# EAGLE design M141X (EAGLE 4.11)
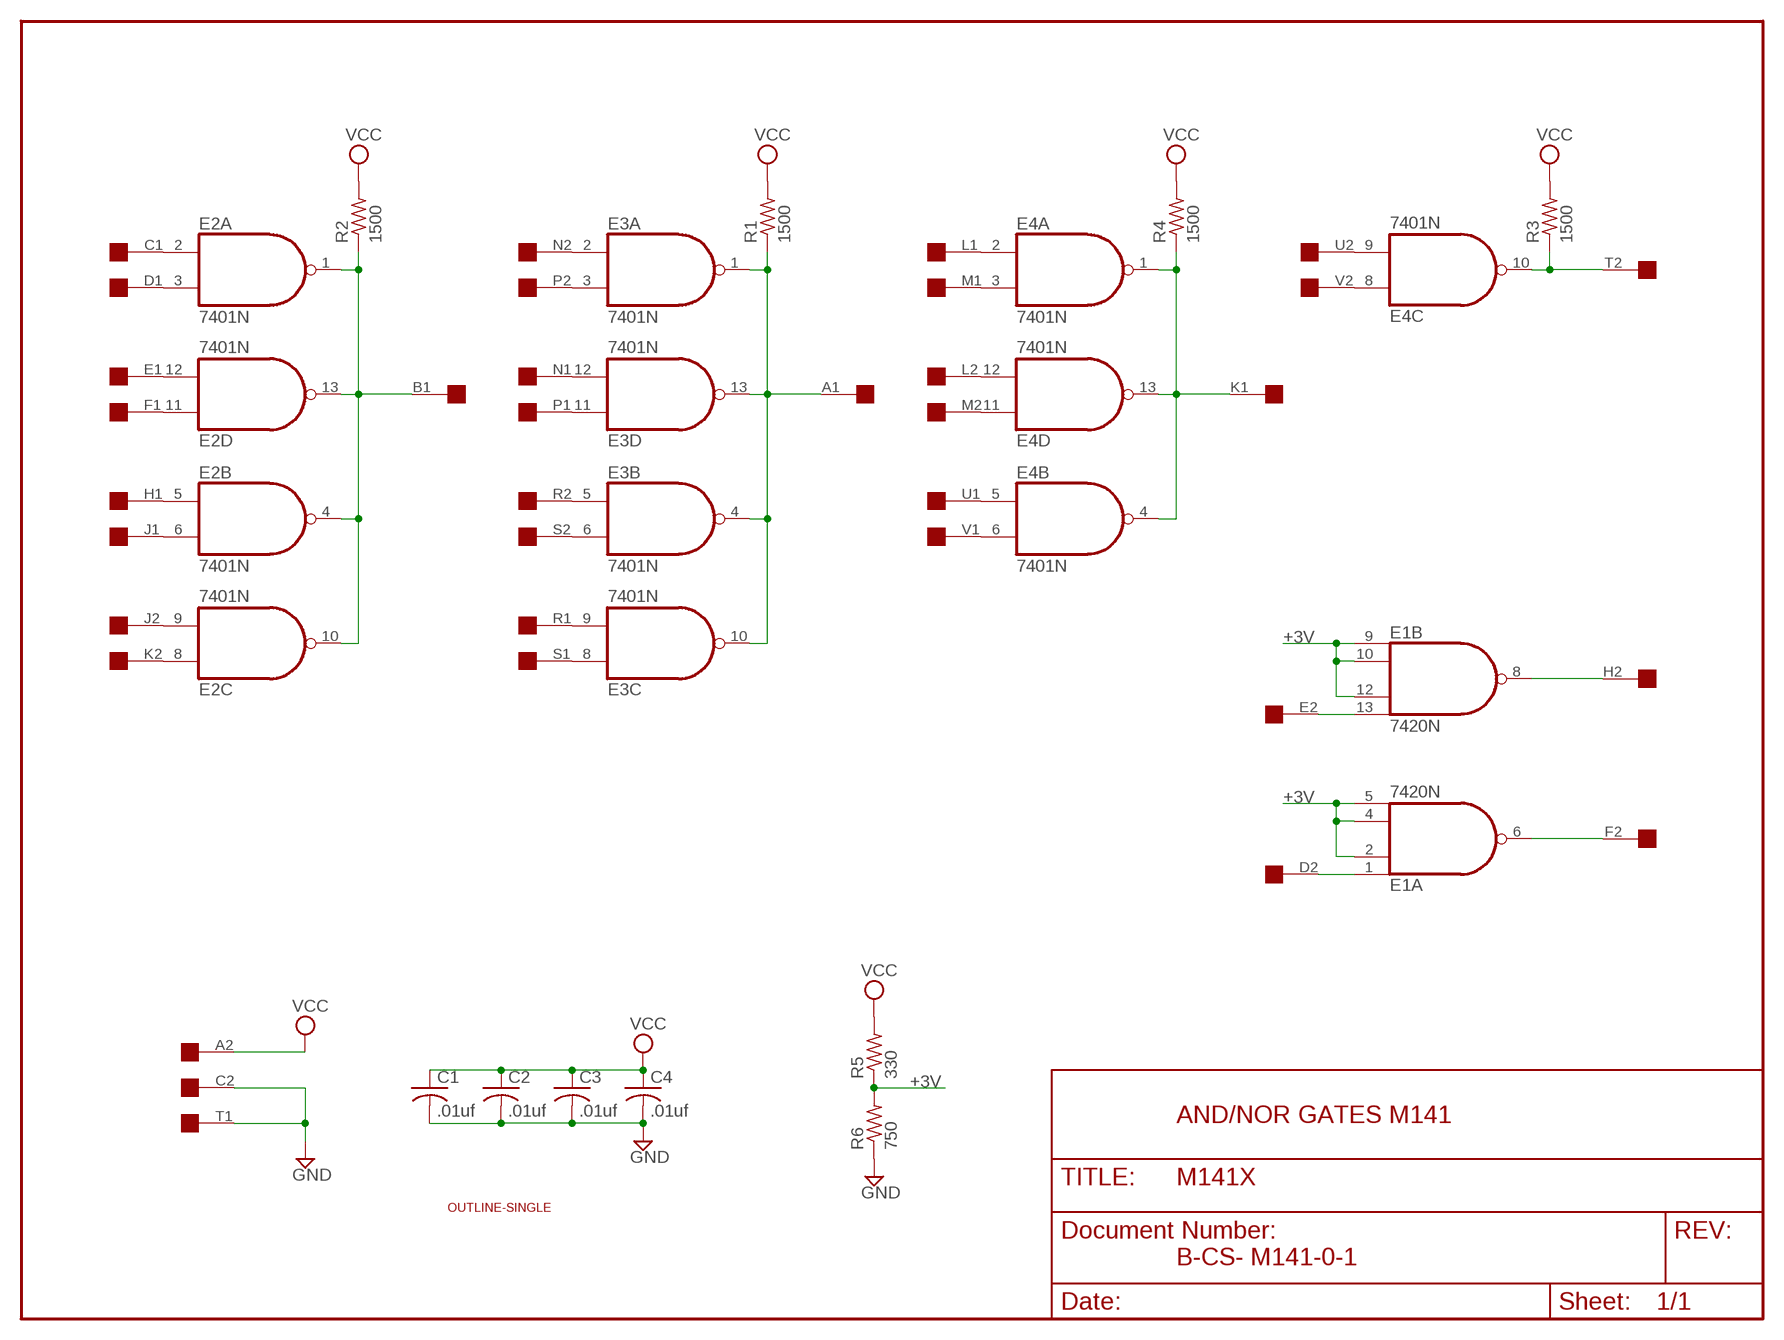
[diagram p0: schematic, sheet 1]

## Parts
C1  .01uf  C-US050-025X075  [C050-025X075]
C2  .01uf  C-US050-025X075  [C050-025X075]
C3  .01uf  C-US050-025X075  [C050-025X075]
C4  .01uf  C-US050-025X075  [C050-025X075]
E1  7420N  74S20N  [DIL14]
E2  7401N  74LS01N  [DIL14]
E3  7401N  74LS01N  [DIL14]
E4  7401N  74LS01N  [DIL14]
R1  1500  R-US_0207/10  [0207/10]
R2  1500  R-US_0207/10  [0207/10]
R3  1500  R-US_0207/10  [0207/10]
R4  1500  R-US_0207/10  [0207/10]
R5  330  R-US_0207/10  [0207/10]
R6  750  R-US_0207/10  [0207/10]
U$1  OUTLINE-SINGLE  [SINGLE]
U$4  SINGLE  [EDGE-CON2]

## Nets
+3V: E1.2(A:I1) E1.4(A:I2) E1.5(A:I3) E1.9(B:I0) E1.10(B:I1) E1.12(B:I2) R5.1 R6.2
GND [Supply]: C1.2 C2.2 C3.2 C4.2 R6.1 U$4.C2 U$4.T1
N$1: E2.2(A:I0) U$4.C1
N$2: E2.3(A:I1) U$4.D1
N$3: E2.12(D:I1) U$4.E1
N$4: E2.11(D:I0) U$4.F1
N$5: E2.5(B:I0) U$4.H1
N$6: E2.6(B:I1) U$4.J1
N$7: E2.8(C:I0) U$4.K2
N$8: E2.9(C:I1) U$4.J2
N$9: E2.1(A:O) E2.4(B:O) E2.10(C:O) E2.13(D:O) R2.1 U$4.B1
N$10: E3.3(A:I1) U$4.P2
N$11: E3.2(A:I0) U$4.N2
N$12: E3.12(D:I1) U$4.N1
N$13: E3.11(D:I0) U$4.P1
N$14: E3.6(B:I1) U$4.S2
N$15: E3.5(B:I0) U$4.R2
N$16: E3.9(C:I1) U$4.R1
N$17: E3.8(C:I0) U$4.S1
N$18: E3.1(A:O) E3.4(B:O) E3.10(C:O) E3.13(D:O) R1.1 U$4.A1
N$19: E4.12(D:I1) U$4.L2
N$20: E4.11(D:I0) U$4.M2
N$21: E4.2(A:I0) U$4.L1
N$22: E4.3(A:I1) U$4.M1
N$23: E4.5(B:I0) U$4.U1
N$24: E4.6(B:I1) U$4.V1
N$25: E4.1(A:O) E4.4(B:O) E4.13(D:O) R4.1 U$4.K1
N$26: E4.9(C:I1) U$4.U2
N$27: E4.8(C:I0) U$4.V2
N$28: E4.10(C:O) R3.1 U$4.T2
N$29: E1.8(B:O) U$4.H2
N$30: E1.6(A:O) U$4.F2
N$31: E1.13(B:I3) U$4.E2
N$32: E1.1(A:I0) U$4.D2
VCC [Supply]: C1.1 C2.1 C3.1 C4.1 R1.2 R2.2 R3.2 R4.2 R5.2 U$4.A2
Unconnected: U$4.B2

## Notes on the sheet
- AND/NOR GATES M141
- B-CS- M141-0-1

## Power pins joined to a net without a drawn wire
GND: E1.7(P:GND) E2.7(P:GND) E3.7(P:GND) E4.7(P:GND)
VCC: E1.14(P:VCC) E2.14(P:VCC) E3.14(P:VCC) E4.14(P:VCC)

## Library data of the parts
C1-C4 = rcl:C-US: CAPACITOR, American symbol
E1 = 74xx-us:74*20: Dual 4-input NAND gate
E2-E4 = 74xx-us:74*01: Quad 2-input NAND gate, open collector
R1-R6 = rcl:R-US_: RESISTOR, American symbol
U$1 = dec-con:OUTLINE-*: Board outlines for DEC boards.
U$4 = dec-con:SINGLE: Single-Height DEC board

## Net classes
1 Supply: width 0.813 mm

## Board
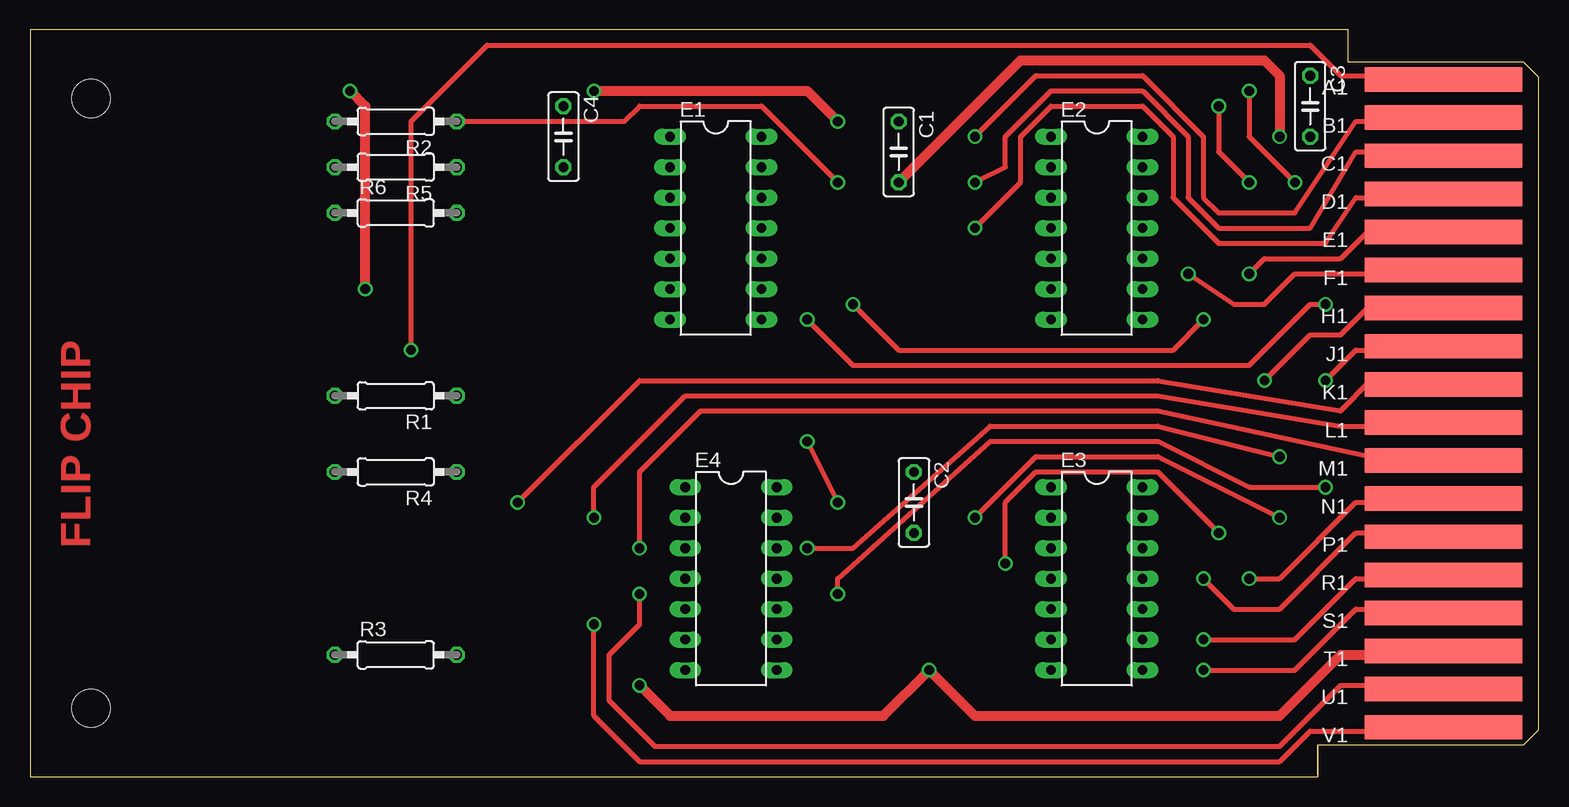
[diagram p1: board, top side]
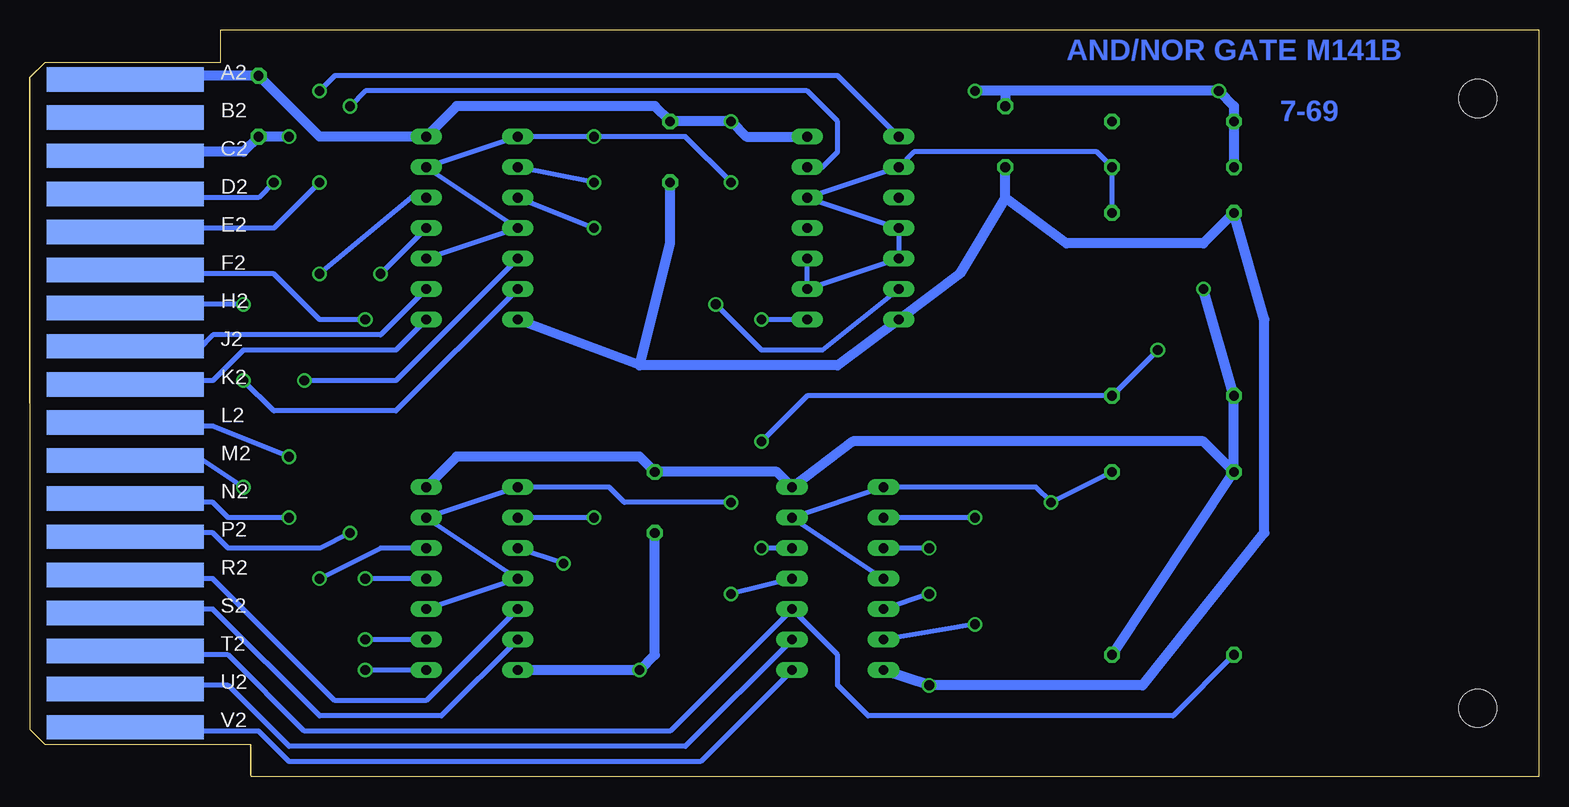
[diagram p2: board, bottom side, seen from below]

Size 125.73 x 62.23 mm. Coordinates in mm from the lower left corner, seen from the top.
Copper layers (1+16): Top 0.035mm / dielectric 1.5mm / Bottom 0.035mm
Design rules "16mils": minimum track width 16mil, minimum drill 32mil, track to track 15mil, track to pad 10mil, pad to pad 10mil, via to via 10mil, smd to smd 10mil, copper to edge 13mil, drill to drill 10mil, minimum pad ring 10mil, minimum via ring 8mil, stop-mask expansion 0mil, vias tented up to drill 0mil, thermal gap 10mil

### Footprints (pad centres in the part's own frame; a part is rotated, then mirrored left to right if it is on the bottom)
C050-025X075 = drill 0.813 octagon: 1 -2.54,0; 2 2.54,0
DIL14 = drill 0.813 long: 1 -7.62,-3.81; 2 -5.08,-3.81; 3 -2.54,-3.81; 4 0,-3.81; 5 2.54,-3.81; 6 5.08,-3.81; 7 7.62,-3.81; 8 7.62,3.81; 9 5.08,3.81; 10 2.54,3.81; 11 0,3.81; 12 -2.54,3.81; 13 -5.08,3.81; 14 -7.62,3.81
0207/10 = drill 0.813 octagon: 1 -5.08,0; 2 5.08,0
SINGLE = hole 3.175: 120.65,56.515; 120.65,5.715
EDGE-CON2 = smd 13.106 x 2.032: A1 7.938,4.128; B1 7.938,7.303; C1 7.938,10.477; D1 7.938,13.652; E1 7.938,16.828; F1 7.938,20.003; H1 7.938,23.177; J1 7.938,26.352; K1 7.938,29.527; L1 7.938,32.703; M1 7.938,35.877; N1 7.938,39.053; P1 7.938,42.227; R1 7.938,45.403; S1 7.938,48.578; T1 7.938,51.752; U1 7.938,54.928; V1 7.938,58.102 | smd 13.106 x 2.032 bottom: A2 7.938,4.128; B2 7.938,7.303; C2 7.938,10.477; D2 7.938,13.652; E2 7.938,16.828; F2 7.938,20.003; H2 7.938,23.177; J2 7.938,26.352; K2 7.938,29.527; L2 7.938,32.703; M2 7.938,35.877; N2 7.938,39.053; P2 7.938,42.227; R2 7.938,45.403; S2 7.938,48.578; T2 7.938,51.752; U2 7.938,54.928; V2 7.938,58.102

### Placement (x,y rotation side)
C1  72.39,52.07 270 top
C2  73.66,22.86 270 top
C3  106.68,55.88 270 top
C4  44.45,53.34 270 top
E1  57.15,45.72 270 top
E2  88.9,45.72 270 top
E3  88.9,16.51 270 top
E4  58.42,16.51 270 top
R1  30.48,31.75 180 top
R2  30.48,54.61 180 top
R3  30.48,10.16 0 top
R4  30.48,25.4 180 top
R5  30.48,50.8 180 top
R6  30.48,46.99 0 top
U$1  125.73,62.23 180 top
U$2  [FLIPCHIP]  0,0 0 top
U$4  125.73,62.23 180 top

### Tracks (layer width: path | path; a pad name or v marks a point on that pad's centre or on a via)
+3V
  Bottom 0.406: R6.2 R5.1 36.83,52.07 52.07,52.07 E1.2 E1.12 E1.4 E1.5 E1.9 E1.10
GND  (via drill 0.81)
  Top 0.813: U$4.T1 117.17,10.49 116.84,10.16 109.22,10.16 104.14,5.08 78.74,5.08 v74.93,8.89 71.12,5.08 53.34,5.08 v50.8,7.62 | v104.14,53.34 104.14,58.42 102.87,59.69 82.55,59.69 C1.2
  Bottom 0.813: E3.7 v74.93,8.89 73.66,10.16 C2.2 | 44.45,48.26 48.26,41.91 E1.7 58.42,34.29 74.93,34.29 | 44.45,48.26 C4.2 | 44.45,48.26 39.37,44.45 27.94,44.45 R6.1 22.86,38.1 22.86,20.32 33.02,7.62 v50.8,7.62 E4.7 | 74.93,34.29 E2.7 | C1.2 72.39,44.45 74.93,34.29 | U$4.C2 117.17,51.74 116.84,52.07 107.95,52.07 C3.2 v104.14,53.34
N$1  (via drill 0.81)
  Top 0.406: U$4.C1 117.17,51.74 116.84,52.07 110.49,52.07 106.68,45.72 99.06,45.72 96.52,48.26 96.52,53.34 92.71,57.15 85.09,57.15 81.28,53.34 81.28,50.8 v78.74,49.53
  Bottom 0.406: v78.74,49.53 E2.2
N$2  (via drill 0.81)
  Top 0.406: U$4.D1 115.88,48.56 115.57,48.26 110.49,48.26 107.95,44.45 99.06,44.45 95.25,48.26 95.25,53.34 92.71,55.88 85.09,55.88 82.55,53.34 82.55,49.53 v78.74,45.72
  Bottom 0.406: v78.74,45.72 E2.3
N$3  (via drill 0.81)
  Top 0.406: U$4.E1 116.84,45.72 111.76,45.72 109.22,43.18 102.87,43.18 v101.6,41.91
  Bottom 0.406: E2.12 93.98,48.26 v101.6,41.91
N$4  (via drill 0.81)
  Top 0.406: U$4.F1 116.84,41.91 105.41,41.91 102.87,39.37 100.33,39.37 v96.52,41.91
  Bottom 0.406: E2.11 v96.52,41.91
N$5  (via drill 0.81)
  Top 0.406: U$4.H1 117.17,39.04 116.84,39.37 111.76,39.37 109.22,36.83 106.68,36.83 105.41,35.56 v102.87,33.02
  Bottom 0.406: E2.5 95.25,33.02 v102.87,33.02
N$6  (via drill 0.81)
  Top 0.406: U$4.J1 116.84,35.56 110.49,35.56 v107.95,33.02
  Bottom 0.406: v107.95,33.02 105.41,30.48 95.25,30.48 E2.6
N$7
  Bottom 0.406: U$4.K2 117.14,32.72 116.84,33.02 110.49,33.02 107.95,35.56 95.25,35.56 E2.8
N$8
  Bottom 0.406: U$4.J2 117.17,35.89 116.84,35.56 111.76,35.56 110.49,36.83 96.52,36.83 E2.9
N$9  (via drill 0.81)
  Top 0.406: R2.1 49.53,54.61 50.8,55.88 60.96,55.88 v67.31,49.53 | U$4.B1 117.13,54.9 116.84,54.61 110.49,54.61 105.41,46.99 99.06,46.99 97.79,48.26 97.79,53.34 92.71,58.42 83.82,58.42 v78.74,53.34
  Bottom 0.406: E2.10 E2.4 E2.13 E2.1 v78.74,53.34 71.12,53.34 v67.31,49.53
N$10  (via drill 0.81)
  Top 0.406: v99.06,20.32 93.98,25.4 83.82,25.4 81.28,22.86 v81.28,17.78
  Bottom 0.406: U$4.P2 116.84,20.32 110.49,20.32 109.22,19.05 101.6,19.05 v99.06,20.32 | v81.28,17.78 E3.3
N$11  (via drill 0.81)
  Top 0.406: v104.14,21.59 93.98,26.67 83.82,26.67 v78.74,21.59
  Bottom 0.406: U$4.N2 116.84,22.86 110.49,22.86 109.22,21.59 v104.14,21.59 | v78.74,21.59 E3.2
N$12  (via drill 0.81)
  Top 0.406: U$4.N1 116.84,22.86 110.49,22.86 104.14,16.51 v101.6,16.51
  Bottom 0.406: v101.6,16.51 96.52,19.05 E3.12
N$13  (via drill 0.81)
  Top 0.406: U$4.P1 116.84,20.32 110.49,20.32 104.14,13.97 100.33,13.97 v97.79,16.51
  Bottom 0.406: E3.11 v97.79,16.51
N$14
  Bottom 0.406: U$4.S2 117.14,13.66 116.84,13.97 110.49,13.97 101.6,5.08 91.44,5.08 E3.6
N$15
  Bottom 0.406: U$4.R2 115.9,16.84 115.57,16.51 110.49,16.51 100.33,6.35 92.71,6.35 E3.5
N$16  (via drill 0.81)
  Top 0.406: U$4.R1 116.84,16.51 110.49,16.51 105.41,11.43 v97.79,11.43
  Bottom 0.406: E3.9 v97.79,11.43
N$17  (via drill 0.81)
  Top 0.406: U$4.S1 116.84,13.97 110.49,13.97 105.41,8.89 v97.79,8.89
  Bottom 0.406: E3.8 v97.79,8.89
N$18  (via drill 0.81)
  Top 0.406: U$4.A1 117.24,58.02 116.84,58.42 109.22,58.42 106.68,60.96 38.1,60.96 31.75,54.61 v31.75,35.56 | v64.77,27.94 v67.31,22.86
  Bottom 0.406: v31.75,35.56 R1.1 60.96,31.75 v64.77,27.94 | v67.31,22.86 76.2,22.86 77.47,24.13 E3.1 E3.13 E3.4 E3.10
N$19  (via drill 0.81)
  Top 0.406: v104.14,26.67 93.98,29.21 80.01,29.21 68.58,19.05 v64.77,19.05
  Bottom 0.406: U$4.L2 117.17,29.54 116.84,29.21 110.49,29.21 v104.14,26.67 | E4.12 v64.77,19.05
N$20  (via drill 0.81)
  Top 0.406: v107.95,24.13 101.6,24.13 93.98,27.94 80.01,27.94 67.31,16.51 v67.31,15.24
  Bottom 0.406: U$4.M2 116.84,26.67 111.76,26.67 v107.95,24.13 | E4.11 v67.31,15.24
N$21  (via drill 0.81)
  Top 0.406: U$4.L1 116.84,29.21 109.22,29.21 93.98,31.75 54.61,31.75 46.99,24.13 v46.99,21.59
  Bottom 0.406: v46.99,21.59 E4.2
N$22  (via drill 0.81)
  Top 0.406: U$4.M1 116.84,26.67 111.76,26.67 93.98,30.48 55.88,30.48 50.8,25.4 v50.8,19.05
  Bottom 0.406: v50.8,19.05 E4.3
N$23  (via drill 0.81)
  Top 0.406: U$4.U1 115.93,7.26 115.57,7.62 109.22,7.62 104.14,2.54 52.07,2.54 48.26,6.35 48.26,10.16 50.8,12.7 v50.8,15.24
  Bottom 0.406: v50.8,15.24 E4.5
N$24  (via drill 0.81)
  Top 0.406: U$4.V1 117.23,4.2 116.84,3.81 106.68,3.81 104.14,1.27 50.8,1.27 46.99,5.08 v46.99,12.7
  Bottom 0.406: v46.99,12.7 E4.6
N$25  (via drill 0.81)
  Top 0.406: U$4.K1 117.78,33.02 111.69,33.02 109.22,30.48 93.98,33.02 50.8,33.02 v40.64,22.86
  Bottom 0.406: R4.1 v40.64,22.86 41.91,24.13 E4.1 E4.13 E4.4
N$26
  Bottom 0.406: U$4.U2 115.93,7.26 115.57,7.62 109.22,7.62 104.14,2.54 71.12,2.54 E4.9
N$27
  Bottom 0.406: U$4.V2 117.23,4.2 116.84,3.81 106.68,3.81 104.14,1.27 69.85,1.27 E4.8
N$28
  Bottom 0.406: U$4.T2 117.17,10.49 116.84,10.16 109.22,10.16 102.87,3.81 72.39,3.81 E4.10 58.42,10.16 58.42,7.62 55.88,5.08 30.48,5.08 R3.1
N$29  (via drill 0.81)
  Top 0.406: v107.95,39.37 106.68,39.37 101.6,34.29 68.58,34.29 v64.77,38.1
  Bottom 0.406: U$4.H2 115.9,39.04 115.57,39.37 v107.95,39.37 | E1.8 v64.77,38.1
N$30  (via drill 0.81)
  Top 0.406: v97.79,38.1 95.25,35.56 72.39,35.56 v68.58,39.37
  Bottom 0.406: U$4.F2 117.12,42.19 116.84,41.91 105.41,41.91 101.6,38.1 v97.79,38.1 | v68.58,39.37 64.77,35.56 59.69,35.56 E1.6
N$31  (via drill 0.81)
  Top 0.406: v101.6,49.53 99.06,52.07 v99.06,55.88
  Bottom 0.406: U$4.E2 116.84,45.72 105.41,45.72 v101.6,49.53 | v99.06,55.88 97.79,57.15 60.96,57.15 58.42,54.61 58.42,52.07 59.69,50.8 E1.13
N$32  (via drill 0.81)
  Top 0.406: v105.41,49.53 101.6,53.34 v101.6,57.15
  Bottom 0.406: U$4.D2 116.84,48.26 106.68,48.26 v105.41,49.53 | v101.6,57.15 100.33,58.42 58.42,58.42 E1.1
VCC  (via drill 0.81)
  Top 0.813: v27.94,40.64 27.94,55.88 v26.67,57.15 | v46.99,57.15 64.77,57.15 v67.31,54.61
  Bottom 0.813: R5.2 R2.2 25.4,55.88 v26.67,57.15 44.45,57.15 | 44.45,57.15 C4.1 | 44.45,57.15 v46.99,57.15 | R3.2 R4.2 | R4.2 R1.2 v27.94,40.64 | R4.2 27.94,27.94 57.15,27.94 E4.14 63.5,25.4 C2.1 74.93,26.67 90.17,26.67 E3.14 | U$4.A2 117.24,58.02 116.84,58.42 C3.1 101.6,53.34 E2.14 90.17,55.88 73.66,55.88 C1.1 v67.31,54.61 66.04,53.34 E1.14

### Text on the board
Bottom: AND/NOR GATE M141B | 7-69